# EAGLE schematic tester (EAGLE 9.6.2)
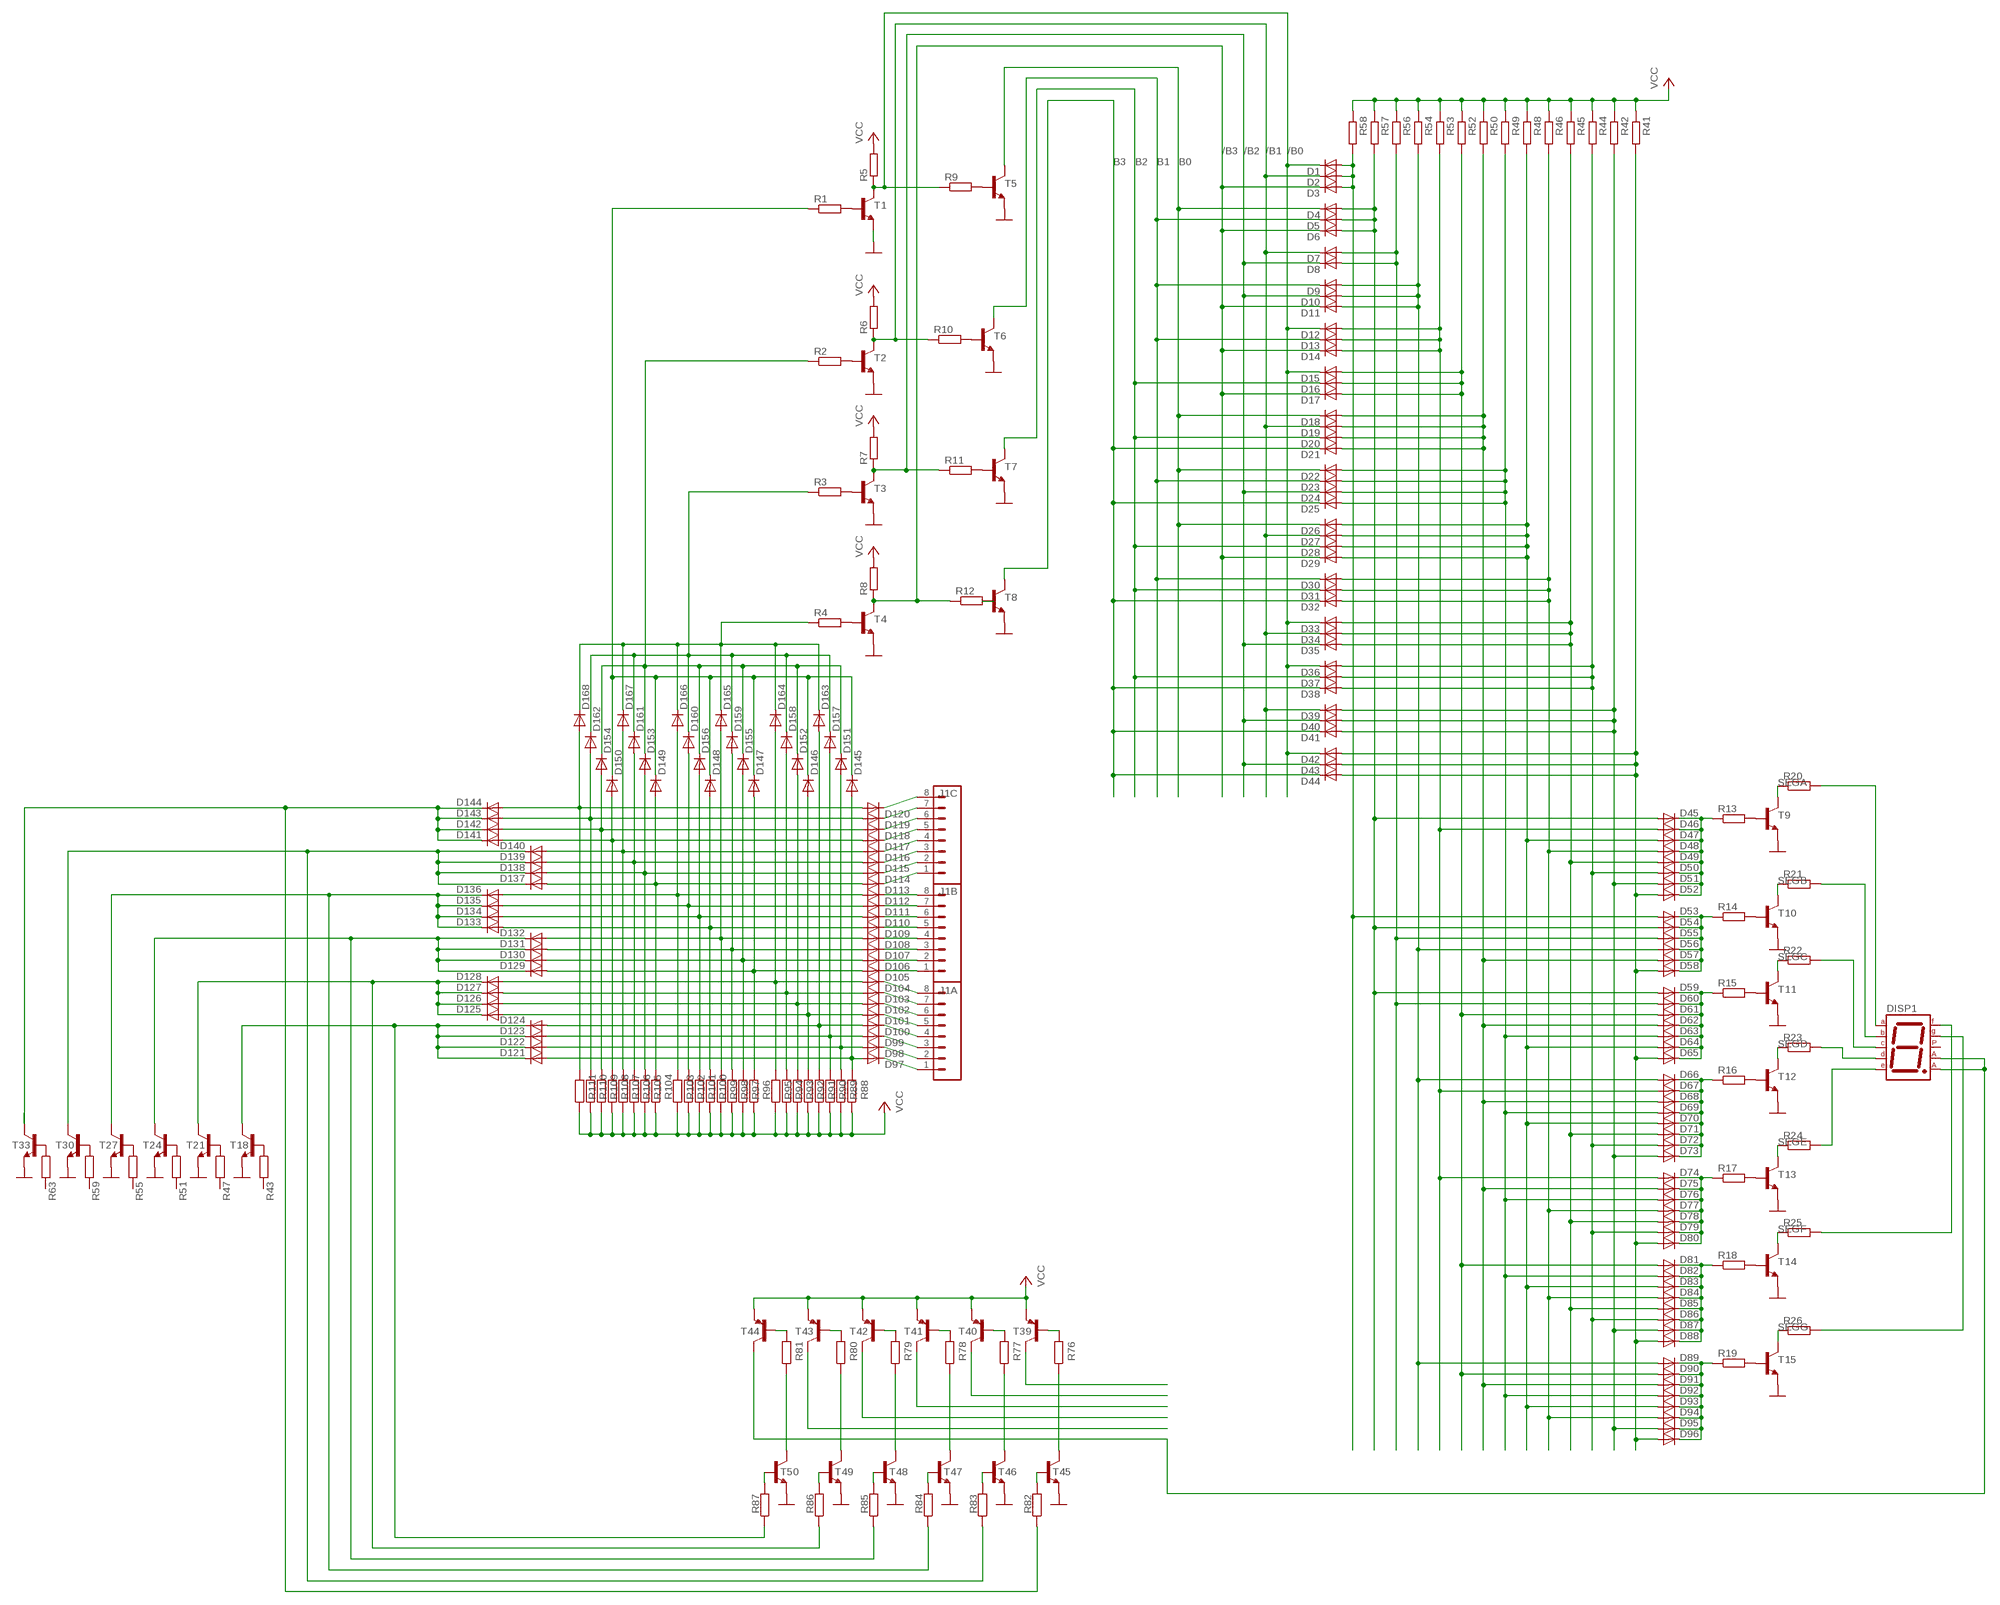
[diagram p0: schematic, sheet 1]

## Parts
D1  SMALL_DIODEDO35-7  [DO35-7]
D2  SMALL_DIODEDO35-7  [DO35-7]
D3  SMALL_DIODEDO35-7  [DO35-7]
D4  SMALL_DIODEDO35-7  [DO35-7]
D5  SMALL_DIODEDO35-7  [DO35-7]
D6  SMALL_DIODEDO35-7  [DO35-7]
D7  SMALL_DIODEDO35-7  [DO35-7]
D8  SMALL_DIODEDO35-7  [DO35-7]
D9  SMALL_DIODEDO35-7  [DO35-7]
D10  SMALL_DIODEDO35-7  [DO35-7]
D11  SMALL_DIODEDO35-7  [DO35-7]
D12  SMALL_DIODEDO35-7  [DO35-7]
D13  SMALL_DIODEDO35-7  [DO35-7]
D14  SMALL_DIODEDO35-7  [DO35-7]
D15  SMALL_DIODEDO35-7  [DO35-7]
D16  SMALL_DIODEDO35-7  [DO35-7]
D17  SMALL_DIODEDO35-7  [DO35-7]
D18  SMALL_DIODEDO35-7  [DO35-7]
D19  SMALL_DIODEDO35-7  [DO35-7]
D20  SMALL_DIODEDO35-7  [DO35-7]
D21  SMALL_DIODEDO35-7  [DO35-7]
D22  SMALL_DIODEDO35-7  [DO35-7]
D23  SMALL_DIODEDO35-7  [DO35-7]
D24  SMALL_DIODEDO35-7  [DO35-7]
D25  SMALL_DIODEDO35-7  [DO35-7]
D26  SMALL_DIODEDO35-7  [DO35-7]
D27  SMALL_DIODEDO35-7  [DO35-7]
D28  SMALL_DIODEDO35-7  [DO35-7]
D29  SMALL_DIODEDO35-7  [DO35-7]
D30  SMALL_DIODEDO35-7  [DO35-7]
D31  SMALL_DIODEDO35-7  [DO35-7]
D32  SMALL_DIODEDO35-7  [DO35-7]
D33  SMALL_DIODEDO35-7  [DO35-7]
D34  SMALL_DIODEDO35-7  [DO35-7]
D35  SMALL_DIODEDO35-7  [DO35-7]
D36  SMALL_DIODEDO35-7  [DO35-7]
D37  SMALL_DIODEDO35-7  [DO35-7]
D38  SMALL_DIODEDO35-7  [DO35-7]
D39  SMALL_DIODEDO35-7  [DO35-7]
D40  SMALL_DIODEDO35-7  [DO35-7]
D41  SMALL_DIODEDO35-7  [DO35-7]
D42  SMALL_DIODEDO35-7  [DO35-7]
D43  SMALL_DIODEDO35-7  [DO35-7]
D44  SMALL_DIODEDO35-7  [DO35-7]
D45  SMALL_DIODEDO35-7  [DO35-7]
D46  SMALL_DIODEDO35-7  [DO35-7]
D47  SMALL_DIODEDO35-7  [DO35-7]
D48  SMALL_DIODEDO35-7  [DO35-7]
D49  SMALL_DIODEDO35-7  [DO35-7]
D50  SMALL_DIODEDO35-7  [DO35-7]
D51  SMALL_DIODEDO35-7  [DO35-7]
D52  SMALL_DIODEDO35-7  [DO35-7]
D53  SMALL_DIODEDO35-7  [DO35-7]
D54  SMALL_DIODEDO35-7  [DO35-7]
D55  SMALL_DIODEDO35-7  [DO35-7]
D56  SMALL_DIODEDO35-7  [DO35-7]
D57  SMALL_DIODEDO35-7  [DO35-7]
D58  SMALL_DIODEDO35-7  [DO35-7]
D59  SMALL_DIODEDO35-7  [DO35-7]
D60  SMALL_DIODEDO35-7  [DO35-7]
D61  SMALL_DIODEDO35-7  [DO35-7]
D62  SMALL_DIODEDO35-7  [DO35-7]
D63  SMALL_DIODEDO35-7  [DO35-7]
D64  SMALL_DIODEDO35-7  [DO35-7]
D65  SMALL_DIODEDO35-7  [DO35-7]
D66  SMALL_DIODEDO35-7  [DO35-7]
D67  SMALL_DIODEDO35-7  [DO35-7]
D68  SMALL_DIODEDO35-7  [DO35-7]
D69  SMALL_DIODEDO35-7  [DO35-7]
D70  SMALL_DIODEDO35-7  [DO35-7]
D71  SMALL_DIODEDO35-7  [DO35-7]
D72  SMALL_DIODEDO35-7  [DO35-7]
D73  SMALL_DIODEDO35-7  [DO35-7]
D74  SMALL_DIODEDO35-7  [DO35-7]
D75  SMALL_DIODEDO35-7  [DO35-7]
D76  SMALL_DIODEDO35-7  [DO35-7]
D77  SMALL_DIODEDO35-7  [DO35-7]
D78  SMALL_DIODEDO35-7  [DO35-7]
D79  SMALL_DIODEDO35-7  [DO35-7]
D80  SMALL_DIODEDO35-7  [DO35-7]
D81  SMALL_DIODEDO35-7  [DO35-7]
D82  SMALL_DIODEDO35-7  [DO35-7]
D83  SMALL_DIODEDO35-7  [DO35-7]
D84  SMALL_DIODEDO35-7  [DO35-7]
D85  SMALL_DIODEDO35-7  [DO35-7]
D86  SMALL_DIODEDO35-7  [DO35-7]
D87  SMALL_DIODEDO35-7  [DO35-7]
D88  SMALL_DIODEDO35-7  [DO35-7]
D89  SMALL_DIODEDO35-7  [DO35-7]
D90  SMALL_DIODEDO35-7  [DO35-7]
D91  SMALL_DIODEDO35-7  [DO35-7]
D92  SMALL_DIODEDO35-7  [DO35-7]
D93  SMALL_DIODEDO35-7  [DO35-7]
D94  SMALL_DIODEDO35-7  [DO35-7]
D95  SMALL_DIODEDO35-7  [DO35-7]
D96  SMALL_DIODEDO35-7  [DO35-7]
D97  SMALL_DIODEDO35-7  [DO35-7]
D98  SMALL_DIODEDO35-7  [DO35-7]
D99  SMALL_DIODEDO35-7  [DO35-7]
D100  SMALL_DIODEDO35-7  [DO35-7]
D101  SMALL_DIODEDO35-7  [DO35-7]
D102  SMALL_DIODEDO35-7  [DO35-7]
D103  SMALL_DIODEDO35-7  [DO35-7]
D104  SMALL_DIODEDO35-7  [DO35-7]
D105  SMALL_DIODEDO35-7  [DO35-7]
D106  SMALL_DIODEDO35-7  [DO35-7]
D107  SMALL_DIODEDO35-7  [DO35-7]
D108  SMALL_DIODEDO35-7  [DO35-7]
D109  SMALL_DIODEDO35-7  [DO35-7]
D110  SMALL_DIODEDO35-7  [DO35-7]
D111  SMALL_DIODEDO35-7  [DO35-7]
D112  SMALL_DIODEDO35-7  [DO35-7]
D113  SMALL_DIODEDO35-7  [DO35-7]
D114  SMALL_DIODEDO35-7  [DO35-7]
D115  SMALL_DIODEDO35-7  [DO35-7]
D116  SMALL_DIODEDO35-7  [DO35-7]
D117  SMALL_DIODEDO35-7  [DO35-7]
D118  SMALL_DIODEDO35-7  [DO35-7]
D119  SMALL_DIODEDO35-7  [DO35-7]
D120  SMALL_DIODEDO35-7  [DO35-7]
D121  SMALL_DIODEDO35-7  [DO35-7]
D122  SMALL_DIODEDO35-7  [DO35-7]
D123  SMALL_DIODEDO35-7  [DO35-7]
D124  SMALL_DIODEDO35-7  [DO35-7]
D125  SMALL_DIODEDO35-7  [DO35-7]
D126  SMALL_DIODEDO35-7  [DO35-7]
D127  SMALL_DIODEDO35-7  [DO35-7]
D128  SMALL_DIODEDO35-7  [DO35-7]
D129  SMALL_DIODEDO35-7  [DO35-7]
D130  SMALL_DIODEDO35-7  [DO35-7]
D131  SMALL_DIODEDO35-7  [DO35-7]
D132  SMALL_DIODEDO35-7  [DO35-7]
D133  SMALL_DIODEDO35-7  [DO35-7]
D134  SMALL_DIODEDO35-7  [DO35-7]
D135  SMALL_DIODEDO35-7  [DO35-7]
D136  SMALL_DIODEDO35-7  [DO35-7]
D137  SMALL_DIODEDO35-7  [DO35-7]
D138  SMALL_DIODEDO35-7  [DO35-7]
D139  SMALL_DIODEDO35-7  [DO35-7]
D140  SMALL_DIODEDO35-7  [DO35-7]
D141  SMALL_DIODEDO35-7  [DO35-7]
D142  SMALL_DIODEDO35-7  [DO35-7]
D143  SMALL_DIODEDO35-7  [DO35-7]
D144  SMALL_DIODEDO35-7  [DO35-7]
D145  SMALL_DIODEDO35-7  [DO35-7]
D146  SMALL_DIODEDO35-7  [DO35-7]
D147  SMALL_DIODEDO35-7  [DO35-7]
D148  SMALL_DIODEDO35-7  [DO35-7]
D149  SMALL_DIODEDO35-7  [DO35-7]
D150  SMALL_DIODEDO35-7  [DO35-7]
D151  SMALL_DIODEDO35-7  [DO35-7]
D152  SMALL_DIODEDO35-7  [DO35-7]
D153  SMALL_DIODEDO35-7  [DO35-7]
D154  SMALL_DIODEDO35-7  [DO35-7]
D155  SMALL_DIODEDO35-7  [DO35-7]
D156  SMALL_DIODEDO35-7  [DO35-7]
D157  SMALL_DIODEDO35-7  [DO35-7]
D158  SMALL_DIODEDO35-7  [DO35-7]
D159  SMALL_DIODEDO35-7  [DO35-7]
D160  SMALL_DIODEDO35-7  [DO35-7]
D161  SMALL_DIODEDO35-7  [DO35-7]
D162  SMALL_DIODEDO35-7  [DO35-7]
D163  SMALL_DIODEDO35-7  [DO35-7]
D164  SMALL_DIODEDO35-7  [DO35-7]
D165  SMALL_DIODEDO35-7  [DO35-7]
D166  SMALL_DIODEDO35-7  [DO35-7]
D167  SMALL_DIODEDO35-7  [DO35-7]
D168  SMALL_DIODEDO35-7  [DO35-7]
DISP1  7SEG-CA  [7SEG-13]
J1A  CONN_08"  [1X08]
J1B  CONN_08"  [1X08]
J1C  CONN_08"  [1X08]
R1  RESISTOR7MM  [7MM_RESISTOR]
R2  RESISTOR7MM  [7MM_RESISTOR]
R3  RESISTOR7MM  [7MM_RESISTOR]
R4  RESISTOR7MM  [7MM_RESISTOR]
R5  RESISTOR7MM  [7MM_RESISTOR]
R6  RESISTOR7MM  [7MM_RESISTOR]
R7  RESISTOR7MM  [7MM_RESISTOR]
R8  RESISTOR7MM  [7MM_RESISTOR]
R9  RESISTOR7MM  [7MM_RESISTOR]
R10  RESISTOR7MM  [7MM_RESISTOR]
R11  RESISTOR7MM  [7MM_RESISTOR]
R12  RESISTOR7MM  [7MM_RESISTOR]
R13  RESISTOR7MM  [7MM_RESISTOR]
R14  RESISTOR7MM  [7MM_RESISTOR]
R15  RESISTOR7MM  [7MM_RESISTOR]
R16  RESISTOR7MM  [7MM_RESISTOR]
R17  RESISTOR7MM  [7MM_RESISTOR]
R18  RESISTOR7MM  [7MM_RESISTOR]
R19  RESISTOR7MM  [7MM_RESISTOR]
R20  RESISTOR7MM  [7MM_RESISTOR]
R21  RESISTOR7MM  [7MM_RESISTOR]
R22  RESISTOR7MM  [7MM_RESISTOR]
R23  RESISTOR7MM  [7MM_RESISTOR]
R24  RESISTOR7MM  [7MM_RESISTOR]
R25  RESISTOR7MM  [7MM_RESISTOR]
R26  RESISTOR7MM  [7MM_RESISTOR]
R41  RESISTOR7MM  [7MM_RESISTOR]
R42  RESISTOR7MM  [7MM_RESISTOR]
R43  RESISTOR7MM  [7MM_RESISTOR]
R44  RESISTOR7MM  [7MM_RESISTOR]
R45  RESISTOR7MM  [7MM_RESISTOR]
R46  RESISTOR7MM  [7MM_RESISTOR]
R47  RESISTOR7MM  [7MM_RESISTOR]
R48  RESISTOR7MM  [7MM_RESISTOR]
R49  RESISTOR7MM  [7MM_RESISTOR]
R50  RESISTOR7MM  [7MM_RESISTOR]
R51  RESISTOR7MM  [7MM_RESISTOR]
R52  RESISTOR7MM  [7MM_RESISTOR]
R53  RESISTOR7MM  [7MM_RESISTOR]
R54  RESISTOR7MM  [7MM_RESISTOR]
R55  RESISTOR7MM  [7MM_RESISTOR]
R56  RESISTOR7MM  [7MM_RESISTOR]
R57  RESISTOR7MM  [7MM_RESISTOR]
R58  RESISTOR7MM  [7MM_RESISTOR]
R59  RESISTOR7MM  [7MM_RESISTOR]
R63  RESISTOR7MM  [7MM_RESISTOR]
R76  RESISTOR7MM  [7MM_RESISTOR]
R77  RESISTOR7MM  [7MM_RESISTOR]
R78  RESISTOR7MM  [7MM_RESISTOR]
R79  RESISTOR7MM  [7MM_RESISTOR]
R80  RESISTOR7MM  [7MM_RESISTOR]
R81  RESISTOR7MM  [7MM_RESISTOR]
R82  RESISTOR7MM  [7MM_RESISTOR]
R83  RESISTOR7MM  [7MM_RESISTOR]
R84  RESISTOR7MM  [7MM_RESISTOR]
R85  RESISTOR7MM  [7MM_RESISTOR]
R86  RESISTOR7MM  [7MM_RESISTOR]
R87  RESISTOR7MM  [7MM_RESISTOR]
R88  RESISTOR7MM  [7MM_RESISTOR]
R89  RESISTOR7MM  [7MM_RESISTOR]
R90  RESISTOR7MM  [7MM_RESISTOR]
R91  RESISTOR7MM  [7MM_RESISTOR]
R92  RESISTOR7MM  [7MM_RESISTOR]
R93  RESISTOR7MM  [7MM_RESISTOR]
R94  RESISTOR7MM  [7MM_RESISTOR]
R95  RESISTOR7MM  [7MM_RESISTOR]
R96  RESISTOR7MM  [7MM_RESISTOR]
R97  RESISTOR7MM  [7MM_RESISTOR]
R98  RESISTOR7MM  [7MM_RESISTOR]
R99  RESISTOR7MM  [7MM_RESISTOR]
R100  RESISTOR7MM  [7MM_RESISTOR]
R101  RESISTOR7MM  [7MM_RESISTOR]
R102  RESISTOR7MM  [7MM_RESISTOR]
R103  RESISTOR7MM  [7MM_RESISTOR]
R104  RESISTOR7MM  [7MM_RESISTOR]
R105  RESISTOR7MM  [7MM_RESISTOR]
R106  RESISTOR7MM  [7MM_RESISTOR]
R107  RESISTOR7MM  [7MM_RESISTOR]
R108  RESISTOR7MM  [7MM_RESISTOR]
R109  RESISTOR7MM  [7MM_RESISTOR]
R110  RESISTOR7MM  [7MM_RESISTOR]
R111  RESISTOR7MM  [7MM_RESISTOR]
T1  BC547B-NPN-TO92-CBE  [TO92-CBE]
T2  BC547B-NPN-TO92-CBE  [TO92-CBE]
T3  BC547B-NPN-TO92-CBE  [TO92-CBE]
T4  BC547B-NPN-TO92-CBE  [TO92-CBE]
T5  BC547B-NPN-TO92-CBE  [TO92-CBE]
T6  BC547B-NPN-TO92-CBE  [TO92-CBE]
T7  BC547B-NPN-TO92-CBE  [TO92-CBE]
T8  BC547B-NPN-TO92-CBE  [TO92-CBE]
T9  BC547B-NPN-TO92-CBE  [TO92-CBE]
T10  BC547B-NPN-TO92-CBE  [TO92-CBE]
T11  BC547B-NPN-TO92-CBE  [TO92-CBE]
T12  BC547B-NPN-TO92-CBE  [TO92-CBE]
T13  BC547B-NPN-TO92-CBE  [TO92-CBE]
T14  BC547B-NPN-TO92-CBE  [TO92-CBE]
T15  BC547B-NPN-TO92-CBE  [TO92-CBE]
T18  BC547B-NPN-TO92-CBE  [TO92-CBE]
T21  BC547B-NPN-TO92-CBE  [TO92-CBE]
T24  BC547B-NPN-TO92-CBE  [TO92-CBE]
T27  BC547B-NPN-TO92-CBE  [TO92-CBE]
T30  BC547B-NPN-TO92-CBE  [TO92-CBE]
T33  BC547B-NPN-TO92-CBE  [TO92-CBE]
T39  BC557B-PNP-TO92-EBC  [TO92-EBC]
T40  BC557B-PNP-TO92-EBC  [TO92-EBC]
T41  BC557B-PNP-TO92-EBC  [TO92-EBC]
T42  BC557B-PNP-TO92-EBC  [TO92-EBC]
T43  BC557B-PNP-TO92-EBC  [TO92-EBC]
T44  BC557B-PNP-TO92-EBC  [TO92-EBC]
T45  BC547B-NPN-TO92-CBE  [TO92-CBE]
T46  BC547B-NPN-TO92-CBE  [TO92-CBE]
T47  BC547B-NPN-TO92-CBE  [TO92-CBE]
T48  BC547B-NPN-TO92-CBE  [TO92-CBE]
T49  BC547B-NPN-TO92-CBE  [TO92-CBE]
T50  BC547B-NPN-TO92-CBE  [TO92-CBE]

## Nets
/B0: D1.C D12.C D15.C D33.C D36.C D42.C R5.1 R9.1 T1.C
/B1: D2.C D7.C D19.C D27.C D34.C D39.C R6.1 R10.1 T2.C
/B2: D8.C D10.C D24.C D35.C D40.C D43.C R7.1 R11.1 T3.C
/B3: D3.C D6.C D11.C D14.C D17.C D29.C R8.1 R12.1 T4.C
B0: D4.C D18.C D22.C D26.C T5.C
B1: D5.C D9.C D13.C D23.C D30.C T6.C
B2: D16.C D20.C D28.C D31.C D37.C T7.C
B3: D21.C D25.C D32.C D38.C D41.C D44.C T8.C
GND [PWR]: T1.E T2.E T3.E T4.E T5.E T6.E T7.E T8.E T9.E T10.E T11.E T12.E T13.E T14.E T15.E T18.E T21.E T24.E T27.E T30.E T33.E T45.E T46.E T47.E T48.E T49.E T50.E
I9: D26.A D27.A D28.A D29.A D47.A D64.A D70.A D83.A D93.A R48.2
I10: D30.A D31.A D32.A D48.A D77.A D84.A D94.A R46.2
I11: D33.A D34.A D35.A D49.A D71.A D78.A D85.A R45.2
I12: D36.A D37.A D38.A D50.A D72.A D79.A D86.A R44.2
I13: D39.A D40.A D41.A D51.A D73.A D87.A D95.A R42.2
I14: D42.A D43.A D44.A D52.A D58.A D65.A D80.A D88.A D96.A R41.2
IN0: D145.C D146.C D147.C D148.C D149.C D150.C R1.1
IN1: D151.C D152.C D153.C D154.C D155.C D156.C R2.1
IN2: D157.C D158.C D159.C D160.C D161.C D162.C R3.1
IN3: D163.C D164.C D165.C D166.C D167.C D168.C R4.1
N$1: R13.2 T9.B
N$2: DISP1.7(A) R20.2
N$3: R14.2 T10.B
N$4: R15.2 T11.B
N$5: R16.2 T12.B
N$6: R17.2 T13.B
N$7: R18.2 T14.B
N$8: R19.2 T15.B
N$9: DISP1.6(B) R21.2
N$10: DISP1.4(C) R22.2
N$11: DISP1.2(D) R23.2
N$12: DISP1.1(E) R24.2
N$13: DISP1.9(F) R25.2
N$14: DISP1.10(G) R26.2
N$15: D97.C J1A.1
N$16: D1.A D2.A D3.A D53.A R58.2
N$17: D98.C J1A.2
N$18: D99.C J1A.3
N$19: D100.C J1A.4
N$20: D101.C J1A.5
N$21: D102.C J1A.6
N$22: R1.2 T1.B
N$23: R2.2 T2.B
N$24: R3.2 T3.B
N$25: R4.2 T4.B
N$26: R12.2 T8.B
N$27: R11.2 T7.B
N$28: R10.2 T6.B
N$29: R9.2 T5.B
N$30: D103.C J1A.7
N$31: D104.C J1A.8
N$32: D105.C J1B.1
N$33: D106.C J1B.2
N$34: D107.C J1B.3
N$35: D108.C J1B.4
N$36: D109.C J1B.5
N$37: D110.C J1B.6
N$38: D111.C J1B.7
N$39: D112.C J1B.8
N$40: D113.C J1C.1
N$41: D114.C J1C.2
N$42: D115.C J1C.3
N$43: D116.C J1C.4
N$44: D117.C J1C.5
N$45: D118.C J1C.6
N$46: D119.C J1C.7
N$47: D120.C J1C.8
N$48: D97.A D121.A D145.A R88.2
N$49: D99.A D123.A D157.A R90.2
N$50: D100.A D124.A D163.A R91.2
N$51: D101.A D125.A D146.A R92.2
N$52: D102.A D126.A D152.A R93.2
N$53: D103.A D127.A D158.A R94.2
N$54: D104.A D128.A D164.A R95.2
N$55: D105.A D129.A D147.A R96.2
N$56: D106.A D130.A D155.A R97.2
N$57: D107.A D131.A D159.A R98.2
N$58: D108.A D132.A D165.A R99.2
N$59: D109.A D133.A D148.A R100.2
N$60: D110.A D134.A D156.A R101.2
N$61: D111.A D135.A D160.A R102.2
N$62: D112.A D136.A D166.A R103.2
N$63: D113.A D137.A D149.A R104.2
N$64: D114.A D138.A D153.A R105.2
N$65: D115.A D139.A D161.A R106.2
N$66: D116.A D140.A D167.A R107.2
N$67: D117.A D141.A D150.A R108.2
N$68: D118.A D142.A D154.A R109.2
N$69: D119.A D143.A D162.A R110.2
N$70: D120.A D144.A D168.A R111.2
N$71: D129.C D130.C D131.C D132.C R85.1 T24.C
N$72: D137.C D138.C D139.C D140.C R83.1 T30.C
N$75: D98.A D122.A D151.A R89.2
N$78: R43.1 T18.B
N$79: D4.A D5.A D6.A D45.A D54.A D59.A R57.2
N$80: D7.A D8.A D55.A D60.A R56.2
N$81: D9.A D10.A D11.A D56.A D66.A D89.A R54.2
N$82: R47.1 T21.B
N$83: D12.A D13.A D14.A D46.A D67.A D74.A R53.2
N$84: D15.A D16.A D17.A D61.A D81.A D90.A R52.2
N$85: D18.A D19.A D20.A D21.A D57.A D62.A D68.A D75.A D91.A R50.2
N$86: R51.1 T24.B
N$87: D22.A D23.A D24.A D25.A D63.A D69.A D76.A D82.A D92.A R49.2
N$89: DISP1.3(CA1) DISP1.8(CA2) T44.C
N$90: R55.1 T27.B
N$95: R59.1 T30.B
N$98: R63.1 T33.B
N$110: T39.C
N$111: T40.C
N$112: T41.C
N$113: T42.C
N$114: T43.C
N$116: R76.2 T39.B
N$117: R77.2 T40.B
N$118: R78.2 T41.B
N$119: R79.2 T42.B
N$120: R80.2 T43.B
N$121: R81.2 T44.B
N$122: R76.1 T45.C
N$123: R77.1 T46.C
N$124: R78.1 T47.C
N$125: R79.1 T48.C
N$126: R80.1 T49.C
N$127: R81.1 T50.C
N$128: D141.C D142.C D143.C D144.C R82.1 T33.C
N$129: R82.2 T45.B
N$130: R83.2 T46.B
N$131: R84.2 T47.B
N$132: R85.2 T48.B
N$133: D125.C D126.C D127.C D128.C R86.1 T21.C
N$134: R86.2 T49.B
N$135: D121.C D122.C D123.C D124.C R87.1 T18.C
N$136: R87.2 T50.B
N$137: D133.C D134.C D135.C D136.C R84.1 T27.C
ORA: D45.C D46.C D47.C D48.C D49.C D50.C D51.C D52.C R13.1
ORB: D53.C D54.C D55.C D56.C D57.C D58.C R14.1
ORC: D59.C D60.C D61.C D62.C D63.C D64.C D65.C R15.1
ORD: D66.C D67.C D68.C D69.C D70.C D71.C D72.C D73.C R16.1
ORE: D74.C D75.C D76.C D77.C D78.C D79.C D80.C R17.1
ORF: D81.C D82.C D83.C D84.C D85.C D86.C D87.C D88.C R18.1
ORG: D89.C D90.C D91.C D92.C D93.C D94.C D95.C D96.C R19.1
SEGA: R20.1 T9.C
SEGB: R21.1 T10.C
SEGC: R22.1 T11.C
SEGD: R23.1 T12.C
SEGE: R24.1 T13.C
SEGF: R25.1 T14.C
SEGG: R26.1 T15.C
VCC [PWR]: R5.2 R6.2 R7.2 R8.2 R41.1 R42.1 R44.1 R45.1 R46.1 R48.1 R49.1 R50.1 R52.1 R53.1 R54.1 R56.1 R57.1 R58.1 R88.1 R89.1 R90.1 R91.1 R92.1 R93.1 R94.1 R95.1 R96.1 R97.1 R98.1 R99.1 R100.1 R101.1 R102.1 R103.1 R104.1 R105.1 R106.1 R107.1 R108.1 R109.1 R110.1 R111.1 T39.E T40.E T41.E T42.E T43.E T44.E
Unconnected: DISP1.5(DP) R43.2 R47.2 R51.2 R55.2 R59.2 R63.2

## Library data of the parts
D1-D168 = MatsEng:SMALL_DIODE: Small Signal Diode
DISP1 = MatsEng:7SEG-CA: 7-segment DISPLAY single anode, 13 mm
J1A J1B J1C = MatsEng:CONN_08: Multi connection point. Often used as Generic Header-pin footprint for 0.1 inch spaced/style header connections On any of the 0.1 inch spaced packages, you can populate with these: Break Away Headers - Straight <https://www.sparkfun.com/products/116> (PRT-00116) Break Away Male Headers - Right Angle <https://www.sparkfun.com/products/553> (PRT-00553) Female Headers <https://www.sparkfun.com/products/115> (PRT-00115) Break Away Headers - Machine Pin <https://www.sparkfun.com/products/117> (PRT-00117) Break Away Female Headers - Swiss Machine Pin <https://www.sparkfun.com/products/743> (PRT-00743) Arduino Stackable Header - 8 Pin <https://www.sparkfun.com/products/9279> (PRT-09279) For SCREWTERMINALS and SPRING TERMINALS visit here: Screw Terimnals on SparkFun.com <https://www.sparkfun.com/search/results?term=Screw+Terminals> (5mm/3.5mm/2.54mm spacing) This device is also useful as a general connection point to wire up your design to another part of your project. Our various solder wires solder well into these plated through hole pads. Hook-Up Wire - Assortment (Stranded, 22 AWG) <https://www.sparkfun.com/products/11375> (PRT-11375) Hook-Up Wire - Assortment (Solid Core, 22 AWG) <https://www.sparkfun.com/products/11367> (PRT-11367) View the entire wire category on our website here <https://www.sparkfun.com/categories/141> Special notes: Molex polarized connector foot print use with SKU : PRT-08231 with associated crimp pins and housings. 1MM SMD Version SKU: PRT-10208 NOTES ON THE VARIANTS LOCK and LOCK_LONGPADS... This footprint was designed to help hold the alignment of a through-hole component (i.e. 6-pin header) while soldering it into place. You may notice that each hole has been shifted either up or down by 0.005 of an inch from it's more standard position (which is a perfectly straight line). This slight alteration caused the pins (the squares in the middle) to touch the edges of the holes. Because they are alternating, it causes a "brace" to hold the component in place. 0.005 has proven to be the perfect amount of "off-center" position when using our standard breakaway headers. Although looks a little odd when you look at the bare footprint, once you have a header in there, the alteration is very hard to notice. Also,if you push a header all the way into place, it is covered up entirely on the bottom side.; PROD_ID: CONN-10204; SF_ID: PRT-11543
R1-R26 R41-R59 R63 R76-R111 = MatsEng:RESISTOR: Standard resistor, various versions
T1-T15 T18 T21 T24 T27 T30 T33 T45-T50 = MatsEng:*-NPN-: NPN Transistror BF959 corrected 2008.03.06
T39-T44 = MatsEng:*-PNP-: PNP Transistror

## Net classes
0 default: width 0.305 mm, drill 0.4 mm, clearance 0.203 mm
1 PWR: width 0.61 mm, drill 0.4 mm, clearance 0.203 mm